# EAGLE schematic aw_301_runner (EAGLE 6.4)
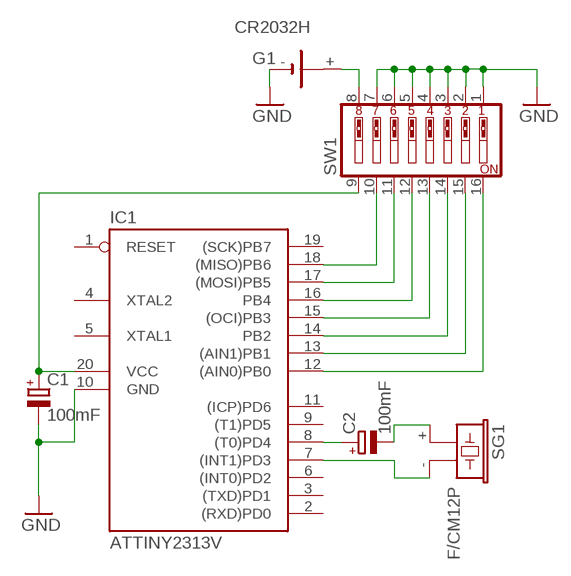
[diagram p0: schematic, sheet 1]

## Parts
C1  100mF  CPOL-EUE2.5-6  [E2,5-6]
C2  100mF  CPOL-EUE2.5-6  [E2,5-6]
G1  CR2032H  [CR2032H]
IC1  ATTINY2313V  AT90S2313P  [DIL20]
SG1  F/CM12P  [F/CM12P]
SW1  SW_DIP-8  [EDG-08]

## Nets
GND: C1.- G1.- IC1.10(GND) SW1.1 SW1.2 SW1.3 SW1.4 SW1.5 SW1.6 SW1.7
N$1: IC1.7((INT1)PD3) SG1.-
N$2: C2.+ IC1.8((T0)PD4)
N$3: C2.- SG1.+
N$4: IC1.12((AIN0)PB0) SW1.16
N$5: C1.+ IC1.20(VCC) SW1.9
N$7: IC1.13((AIN1)PB1) SW1.15
N$8: IC1.14(PB2) SW1.14
N$9: IC1.15((OCI)PB3) SW1.13
N$10: IC1.16(PB4) SW1.12
N$11: IC1.17((MOSI)PB5) SW1.11
N$12: IC1.18((MISO)PB6) SW1.10
VCC: G1.+ SW1.8
Unconnected: G1.+@1(+) IC1.1(RESET) IC1.2((RXD)PD0) IC1.3((TXD)PD1) IC1.4(XTAL2) IC1.5(XTAL1) IC1.6((INT0)PD2) IC1.9((T1)PD5) IC1.11((ICP)PD6) IC1.19((SCK)PB7)

## Library data of the parts
C1 C2 = resistor:CPOL-EU: POLARIZED CAPACITOR, European symbol
G1 = battery:CR2032H: LI BATTERY Varta
IC1 = atmel:AT90S2313: MICROCONTROLLER 2 Kbytes FLASH 128 bytes SRAM 128 bytes EEPROM UART; OC_FARNELL: unknown; OC_NEWARK: unknown
SG1 = buzzer:F/CM12P: BUZZER Source: Buerklin; OC_FARNELL: unknown; OC_NEWARK: unknown
SW1 = special:SW_DIP-8: DIP SWITCH

## Net classes
0 default: width 1.27 mm, clearance 0.762 mm